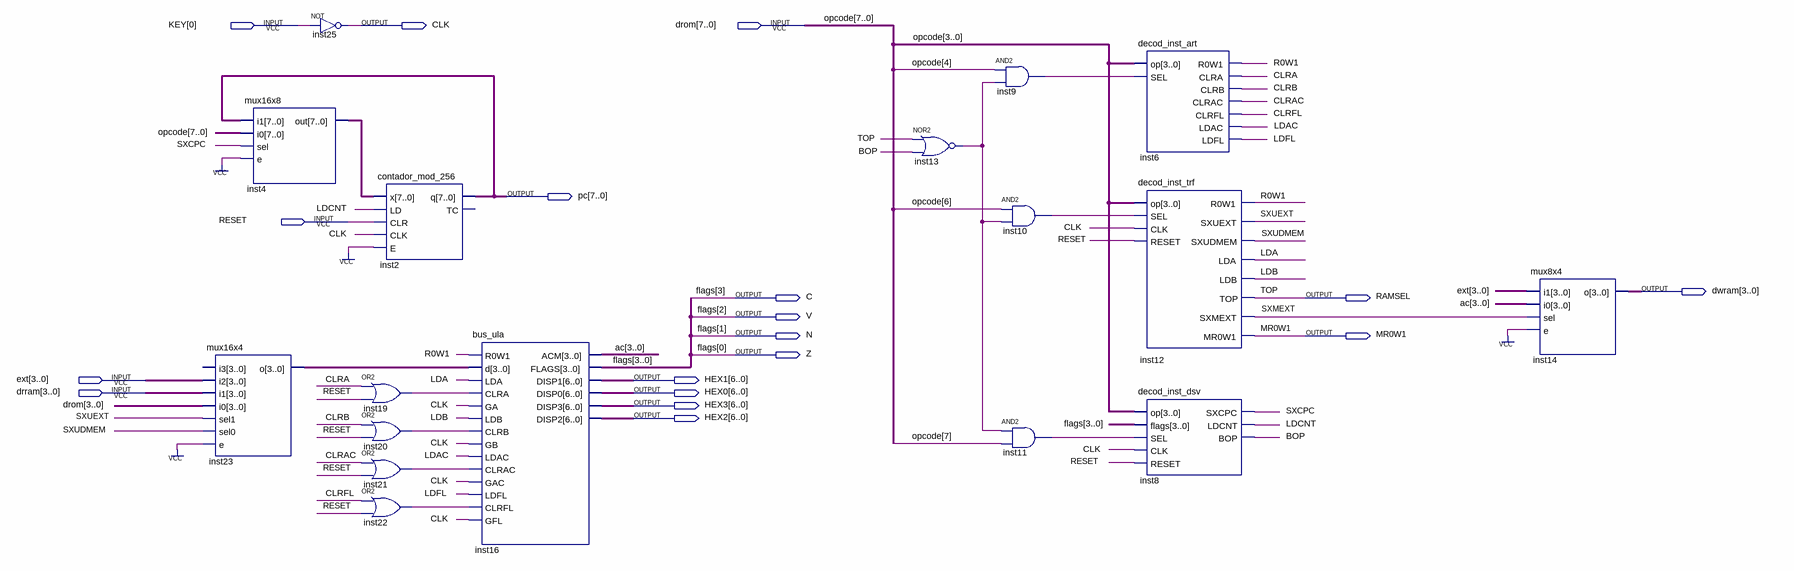
[diagram p0: schematic sheet]
// Quartus schematic cpu.bdf as structural Verilog: 17 symbols, 18 pins
module cpu (
  input  [0:0] KEY,
  input  [7:0] drom,
  input  RESET,
  input  [3:0] ext,
  input  [3:0] drram,
  output CLK,
  output [7:0] pc,
  output [3:0] dwram,
  output C,
  output RAMSEL,
  output V,
  output N,
  output MR0W1,
  output Z,
  output [6:0] HEX1,
  output [6:0] HEX0,
  output [6:0] HEX3,
  output [6:0] HEX2
);

  wire BOP, CLRA, CLRAC, CLRB, CLRFL, inst9_out, inst10_out, inst11_out, inst13_out, inst19_out, inst20_out,
       inst21_out, inst22_out, LDA, LDAC, LDB, LDCNT, LDFL, R0W1, SXCPC, SXMEXT, SXUDMEM, SXUEXT;
  wire [3:0] ac, inst23_o;
  wire [7:0] inst4_out;

  mux16x8 inst4 (.i1(pc), .i0(drom), .sel(SXCPC), .e(1'b1), .out(inst4_out));
  mux16x4 inst23 (
    .sel1(SXUEXT), .sel0(SXUDMEM), .i2(ext), .i1(drram), .i0(drom[3:0]), .e(1'b1), .o(inst23_o));  // open: i3
  not inst25 (CLK, KEY[0]);
  contador_mod_256 inst2 (.x(inst4_out), .LD(LDCNT), .CLR(RESET), .CLK(CLK), .E(1'b1), .q(pc));  // open: TC
  or inst19 (inst19_out, CLRA, RESET);
  or inst20 (inst20_out, CLRB, RESET);
  or inst21 (inst21_out, CLRAC, RESET);
  or inst22 (inst22_out, CLRFL, RESET);
  bus_ula inst16 (
    .R0W1(R0W1), .d(inst23_o), .LDA(LDA), .CLRA(inst19_out), .GA(CLK), .LDB(LDB), .CLRB(inst20_out),
    .GB(CLK), .LDAC(LDAC), .CLRAC(inst21_out), .GAC(CLK), .LDFL(LDFL), .CLRFL(inst22_out), .GFL(CLK),
    .ACM(ac), .FLAGS({C, V, N, Z}), .DISP1(HEX1), .DISP0(HEX0), .DISP3(HEX3), .DISP2(HEX2));
  nor inst13 (inst13_out, RAMSEL, BOP);
  and inst9 (inst9_out, drom[4], inst13_out);
  and inst10 (inst10_out, drom[6], inst13_out);
  and inst11 (inst11_out, inst13_out, drom[7]);
  decod_inst_art inst6 (
    .op(drom[3:0]), .SEL(inst9_out), .R0W1(R0W1), .CLRA(CLRA), .CLRB(CLRB), .CLRAC(CLRAC), .CLRFL(CLRFL),
    .LDAC(LDAC), .LDFL(LDFL));
  decod_inst_trf inst12 (
    .op(drom[3:0]), .SEL(inst10_out), .CLK(CLK), .RESET(RESET), .R0W1(R0W1), .SXUEXT(SXUEXT), .LDB(LDB),
    .MR0W1(MR0W1), .TOP(RAMSEL), .SXUDMEM(SXUDMEM), .LDA(LDA), .SXMEXT(SXMEXT));
  decod_inst_dsv inst8 (
    .op(drom[3:0]), .flags({C, V, N, Z}), .RESET(RESET), .SEL(inst11_out), .CLK(CLK), .LDCNT(LDCNT),
    .SXCPC(SXCPC), .BOP(BOP));
  mux8x4 inst14 (.i1(ext), .i0(ac), .sel(SXMEXT), .e(1'b1), .o(dwram));

  // Other names for the same wires on the sheet: flags[3:0] = {C, V, N, Z}; opcode[7:0] = drom; TOP = RAMSEL
endmodule
